# EAGLE design pomodoro_timer (EAGLE 7.2.0)
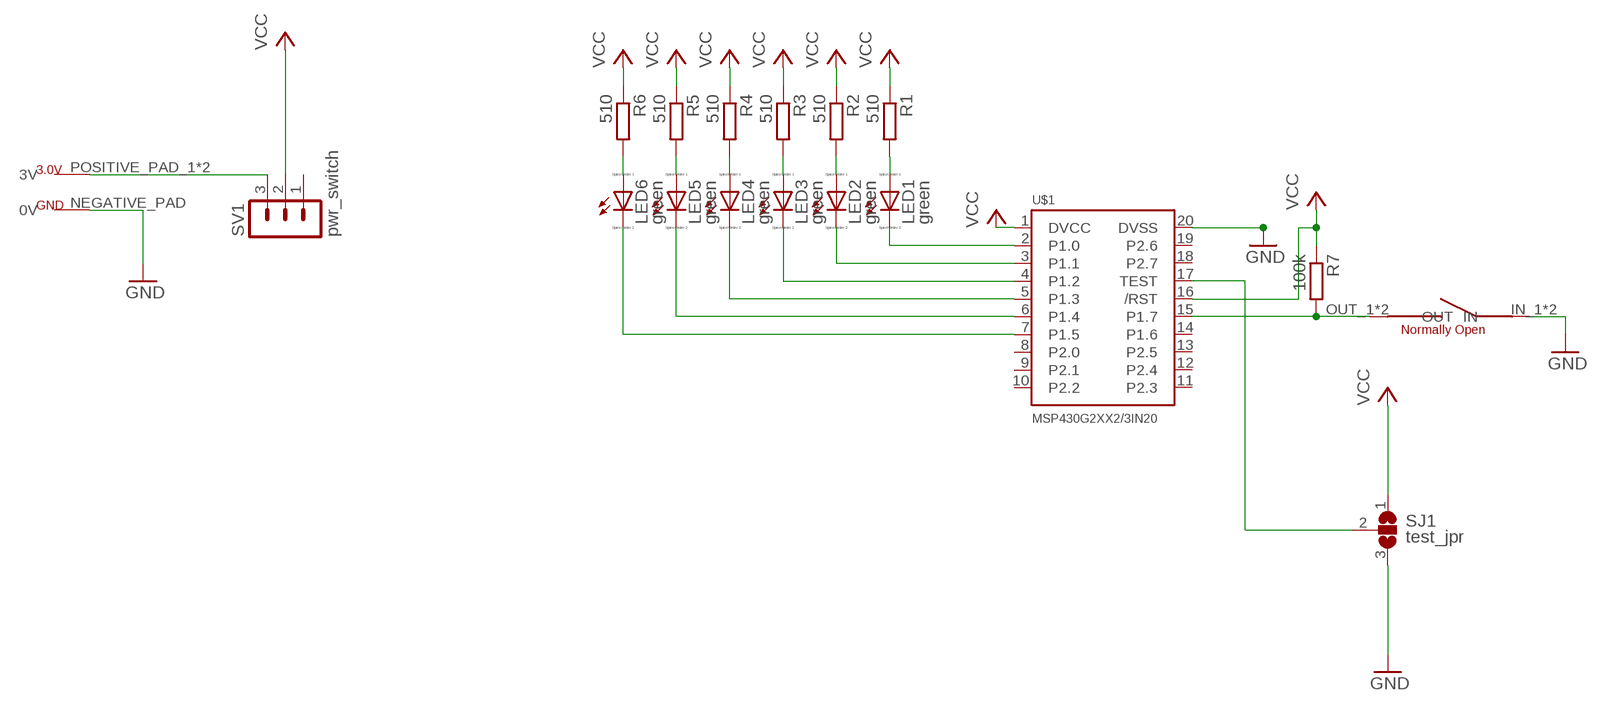
[diagram p0: schematic, sheet 1]

## Parts
LED1  green  LED_E  [LED_1206]
LED2  green  LED_E  [LED_1206]
LED3  green  LED_E  [LED_1206]
LED4  green  LED_E  [LED_1206]
LED5  green  LED_E  [LED_1206]
LED6  green  LED_E  [LED_1206]
R1  510  R-EU_M1206  [M1206]
R2  510  R-EU_M1206  [M1206]
R3  510  R-EU_M1206  [M1206]
R4  510  R-EU_M1206  [M1206]
R5  510  R-EU_M1206  [M1206]
R6  510  R-EU_M1206  [M1206]
R7  100k  R-EU_M1206  [M1206]
SJ1  test_jpr  SJ2W  [SJ_2]
SV1  pwr_switch  MA03-1  [MA03-1]
U$1  MSP430G2XX2/3IN20  [DIL20]
U$2  CR2032_HOLDERNORMAL  [CR2032_HOLDER]
U$3  SWITCH_SIMPLENORMAL  [SWITCH_SIMPLE]

## Nets
GND: SJ1.3 U$1.20(DVSS) U$2.NEGATIVE_PAD(0V) U$3.IN_1(IN) U$3.IN_2(IN)
N$2: LED1.C U$1.2(P1.0)
N$3: LED1.A R1.2
N$4: LED2.A R2.2
N$5: LED3.A R3.2
N$6: LED4.A R4.2
N$7: LED5.A R5.2
N$8: LED6.A R6.2
N$9: LED2.C U$1.3(P1.1)
N$10: LED3.C U$1.4(P1.2)
N$11: LED4.C U$1.5(P1.3)
N$12: LED5.C U$1.6(P1.4)
N$13: LED6.C U$1.7(P1.5)
N$14: R7.2 U$1.15(P1.7) U$3.OUT_1(OUT) U$3.OUT_2(OUT)
N$15: SJ1.2 U$1.17(TEST)
POS_BAT: SV1.3 U$2.POSITIVE_PAD_1(3V) U$2.POSITIVE_PAD_2(3V)
VCC: R1.1 R2.1 R3.1 R4.1 R5.1 R6.1 R7.1 SJ1.1 SV1.2 U$1.1(DVCC) U$1.16(/RST)
Unconnected: SV1.1 U$1.8(P2.0) U$1.9(P2.1) U$1.10(P2.2) U$1.11(P2.3) U$1.12(P2.4) U$1.13(P2.5) U$1.14(P1.6) U$1.18(P2.7) U$1.19(P2.6)

## Library data of the parts
LED1-LED6 = eagle-ltspice:LED_E: LED Source: http://www.osram.convergy.de Source: www.luxeon.com Source: www.kingbright.com; SPICEMODEL: NONE; SPICEPREFIX: D; SPICETYPE: diode
R1-R7 = resistor:R-EU_: RESISTOR, European symbol
SJ1 = jumper:SJ2W: SMD solder JUMPER
SV1 = con-lstb:MA03-1: PIN HEADER; OC_FARNELL: unknown; OC_NEWARK: unknown
U$1 = ti_msp430gxxx:MSP430G2XX2/3: Mixed Signal Microcontroller MSP430 Value Line MSP430G2432: 1x EEM, 8 KiB Flash Memory, 256 B RAM, 1x Timer_A, 1x USI, 8x ADC10 Ch, 16x I/O MSP430G2332: 1x EEM, 4 KiB Flash Memory, 256 B RAM, 1x Timer_A, 1x USI, 8x ADC10 Ch, 16x I/O MSP430G2232: 1x EEM, 2 KiB Flash Memory, 256 B RAM, 1x Timer_A, 1x USI, 8x ADC10 Ch, 16x I/O MSP430G2132: 1x EEM, 1 KiB Flash Memory, 128 B RAM, 1x Timer_A, 1x USI, 8x ADC10 Ch, 16x I/O MSP430G2402: 1x EEM, 8 KiB Flash Memory, 256 B RAM, 1x Timer_A, 1x USI, 16x I/O MSP430G2302: 1x EEM, 4 KiB Flash Memory, 256 B RAM, 1x Timer_A, 1x USI, 16x I/O MSP430G2202: 1x EEM, 2 KiB Flash Memory, 256 B RAM, 1x Timer_A, 1x USI, 16x I/O MSP430G2102: 1x EEM, 1 KiB Flash Memory, 128 B RAM, 1x Timer_A, 1x USI, 16x I/O MSP430G2452: 1x EEM, 8 KiB Flash Memory, 256 B RAM, 1x Timer_A, 8x Comp_A Ch, 1x USI, 8x ADC10 Ch, 16x I/O MSP430G2352: 1x EEM, 4 KiB Flash Memory, 256 B RAM, 1x Timer_A, 8x Comp_A Ch, 1x USI, 8x ADC10 Ch, 16x I/O MSP430G2252: 1x EEM, 2 KiB Flash Memory, 256 B RAM, 1x Timer_A, 8x Comp_A Ch, 1x USI, 8x ADC10 Ch, 16x I/O MSP430G2152: 1x EEM, 1 KiB Flash Memory, 128 B RAM, 1x Timer_A, 8x Comp_A Ch, 1x USI, 8x ADC10 Ch, 16x I/O MSP430G2412: 1x EEM, 8 KiB Flash Memory, 256 B RAM, 1x Timer_A, 8x Comp_A Ch, 1x USI, 16x I/O MSP430G2312: 1x EEM, 4 KiB Flash Memory, 256 B RAM, 1x Timer_A, 8x Comp_A Ch, 1x USI, 16x I/O MSP430G2212: 1x EEM, 2 KiB Flash Memory, 256 B RAM, 1x Timer_A, 8x Comp_A Ch, 1x USI, 16x I/O MSP430G2112: 1x EEM, 1 KiB Flash Memory, 128 B RAM, 1x Timer_A, 8x Comp_A Ch, 1x USI, 16x I/O MSP430G2533: 1x BSL, 1x EEM, 16 KiB Flash Memory, 512 B RAM, 2x Timer_A, 8x ADC10 Ch, 1x USCI A0/B0, 16x I/O MSP430G2433: 1x BSL, 1x EEM, 8 KiB Flash Memory, 512 B RAM, 2x Timer_A, 8x ADC10 Ch, 1x USCI A0/B0, 16x I/O MSP430G2333: 1x BSL, 1x EEM, 4 KiB Flash Memory, 256 B RAM, 2x Timer_A, 8x ADC10 Ch, 1x USCI A0/B0, 16x I/O MSP430G2233: 1x BSL, 1x EEM, 2 KiB Flash Memory, 256 B RAM, 2x Timer_A, 8x ADC10 Ch, 1x USCI A0/B0, 16x I/O MSP430G2403: 1x BSL, 1x EEM, 8 KiB Flash Memory, 512 B RAM, 2x Timer_A, 1x USCI A0/B0, 16x I/O MSP430G2303: 1x BSL, 1x EEM, 4 KiB Flash Memory, 256 B RAM, 2x Timer_A, 1x USCI A0/B0, 16x I/O MSP430G2203: 1x BSL, 1x EEM, 2 KiB Flash Memory, 256 B RAM, 2x Timer_A, 1x USCI A0/B0, 16x I/O MSP430G2553: 1x BSL, 1x EEM, 16 KiB Flash Memory, 512 B RAM, 2x Timer_A, 8x Comp_A+ Ch, 8x ADC10 Ch, 1x USCI A0/B0, 16x I/O MSP430G2453: 1x BSL, 1x EEM, 8 KiB Flash Memory, 512 B RAM, 2x Timer_A, 8x Comp_A+ Ch, 8x ADC10 Ch, 1x USCI A0/B0, 16x I/O MSP430G2353: 1x BSL, 1x EEM, 4 KiB Flash Memory, 256 B RAM, 2x Timer_A, 8x Comp_A+ Ch, 8x ADC10 Ch, 1x USCI A0/B0, 16x I/O MSP430G2253: 1x BSL, 1x EEM, 2 KiB Flash Memory, 256 B RAM, 2x Timer_A, 8x Comp_A+ Ch, 8x ADC10 Ch, 1x USCI A0/B0, 16x I/O MSP430G2153: 1x BSL, 1x EEM, 1 KiB Flash Memory, 256 B RAM, 2x Timer_A, 8x Comp_A+ Ch, 8x ADC10 Ch, 1x USCI A0/B0, 16x I/O MSP430G2513: 1x BSL, 1x EEM, 16 KiB Flash Memory, 512 B RAM, 2x Timer_A, 8x Comp_A+ Ch, 1x USCI A0/B0, 16x I/O MSP430G2413: 1x BSL, 1x EEM, 8 KiB Flash Memory, 512 B RAM, 2x Timer_A, 8x Comp_A+ Ch, 1x USCI A0/B0, 16x I/O MSP430G2313: 1x BSL, 1x EEM, 4 KiB Flash Memory, 256 B RAM, 2x Timer_A, 8x Comp_A+ Ch, 1x USCI A0/B0, 16x I/O MSP430G2213: 1x BSL, 1x EEM, 2 KiB Flash Memory, 256 B RAM, 2x Timer_A, 8x Comp_A+ Ch, 1x USCI A0/B0, 16x I/O MSP430G2113: 1x BSL, 1x EEM, 1 KiB Flash Memory, 256 B RAM, 2x Timer_A, 8x Comp_A+ Ch, 1x USCI A0/B0, 16x I/O
U$2 = CR2032_HOLDER:CR2032_HOLDER
U$3 = SWITCH_SIMPLE:SWITCH_SIMPLE

## Board
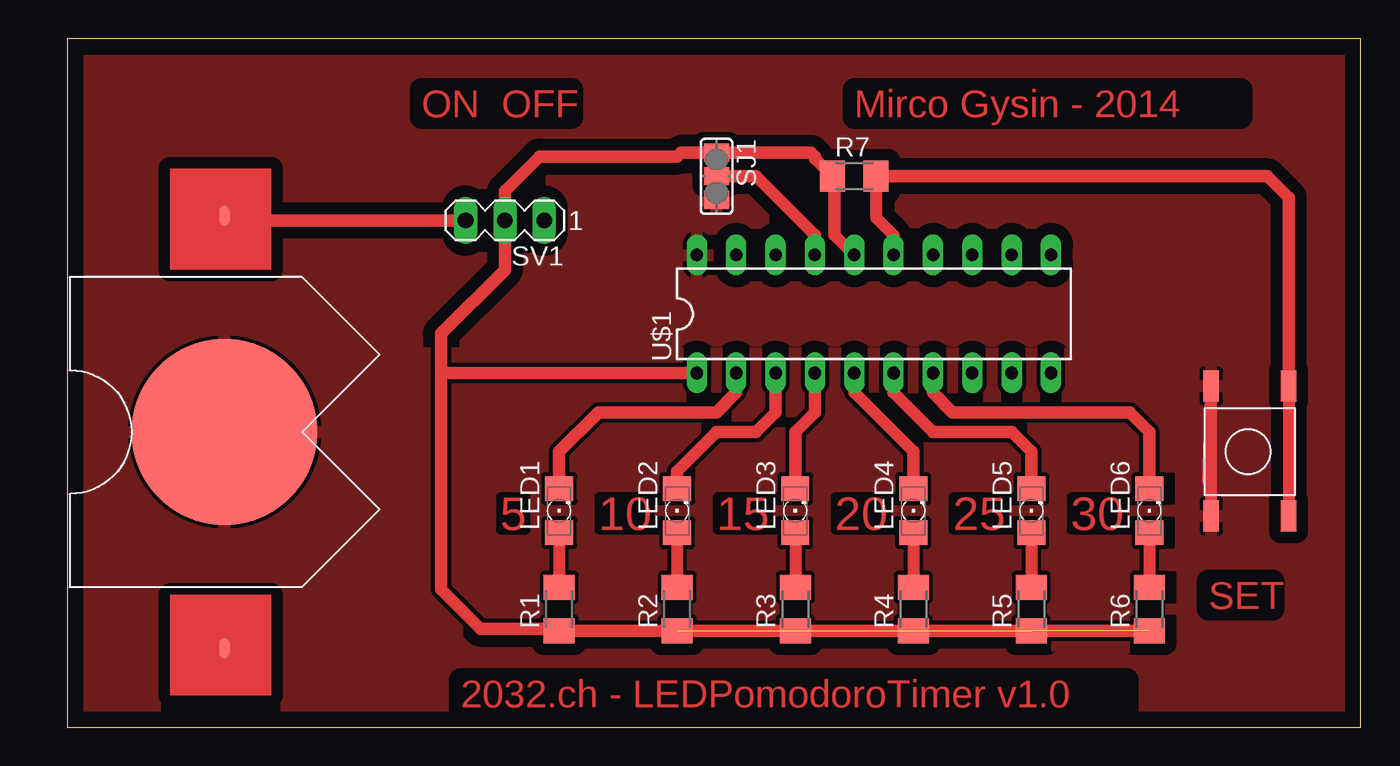
[diagram p1: board, top side]

Size 83.49 x 44.44 mm. Coordinates in mm from the lower left corner, seen from the top.
Outline: 0,0 83.49,0 83.49,44.44 0,44.44 0,0
Copper layers (1*16): Top 0.035mm / dielectric 1.5mm / Bottom 0.035mm
Design rules "default": minimum track width 10mil, minimum drill 24mil, track to track 8mil, track to pad 8mil, pad to pad 8mil, via to via 8mil, smd to smd 8mil, copper to edge 40mil, drill to drill 8mil, minimum pad ring 10mil, minimum via ring 8mil, stop-mask expansion 4mil, vias tented up to drill 0mil, thermal gap 10mil

### Footprints (pad centres in the part's own frame; a part is rotated, then mirrored left to right if it is on the bottom)
LED_1206 = smd 1.6 x 1.803: A -1.422,0; C 1.422,0
M1206 = smd 1.6 x 2: 1 -1.4,0; 2 1.4,0
SJ_2 = smd 1.168 x 1.6: 1 -1.524,0; 2 0,0; 3 1.524,0
MA03-1 = drill 1.016 long: 1 -2.54,0; 2 0,0; 3 2.54,0
DIL20 = drill 0.813 long: 1 -11.43,-3.81; 2 -8.89,-3.81; 3 -6.35,-3.81; 4 -3.81,-3.81; 5 -1.27,-3.81; 6 1.27,-3.81; 7 3.81,-3.81; 8 6.35,-3.81; 9 8.89,-3.81; 10 11.43,-3.81; 11 11.43,3.81; 12 8.89,3.81; 13 6.35,3.81; 14 3.81,3.81; 15 1.27,3.81; 16 -1.27,3.81; 17 -3.81,3.81; 18 -6.35,3.81; 19 -8.89,3.81; 20 -11.43,3.81
CR2032_HOLDER = smd 12 x 12: NEGATIVE_PAD 0,0 | smd 1.27 x 0.635: POSITIVE_PAD_1 -13.97,0; POSITIVE_PAD_2 13.97,0
SWITCH_SIMPLE = smd 2 x 1: IN_1 -4.162,2.362; IN_2 4.238,2.362; OUT_1 -4.162,-2.638; OUT_2 4.238,-2.638

### Placement (x,y rotation side)
LED1  31.75,13.97 90 top
LED2  39.37,13.97 90 top
LED3  46.99,13.97 90 top
LED4  54.61,13.97 90 top
LED5  62.23,13.97 90 top
LED6  69.85,13.97 90 top
R1  31.75,7.62 90 top
R2  39.37,7.62 90 top
R3  46.99,7.62 90 top
R4  54.61,7.62 90 top
R5  62.23,7.62 90 top
R6  69.85,7.62 90 top
R7  50.8,35.56 0 top
SJ1  41.91,35.56 270 top
SV1  28.25,32.71 180 top
U$1  52.07,26.67 0 top
U$2  10.16,19.05 270 top
U$3  76.2,17.78 90 top

### Tracks (layer width: path | path; a pad name or v marks a point on that pad's centre or on a via)
GND
  Top 0.762: U$3.IN_1 U$3.IN_2 73.66,15.85
  pour Top (isolate 0.762): 1.27,43.18 82.55,43.18 82.55,1.27 1.27,1.27
N$1
  pour Top (isolate 0.254): 21.59,24.13 21.59,6.35 71.12,5.08 71.12,24.13
N$2
  Top 0.813: U$1.2 43.18,21.59 41.91,20.32 34.29,20.32 31.75,17.78 LED1.C
N$3
  Top 0.762: LED1.A R1.2
N$4
  Top 0.762: LED2.A R2.2
N$5
  Top 0.762: LED3.A R3.2
N$6
  Top 0.762: LED4.A R4.2
N$7
  Top 0.762: LED5.A R5.2
N$8
  Top 0.762: LED6.A R6.2
N$9
  Top 0.813: U$1.3 45.72,20.32 44.45,19.05 41.91,19.05 39.37,16.51 LED2.C
N$10
  Top 0.813: U$1.4 48.26,20.32 46.99,19.05 LED3.C
N$11
  Top 0.813: U$1.5 50.8,21.59 54.61,17.78 LED4.C
N$12
  Top 0.813: U$1.6 53.34,21.59 55.88,19.05 60.96,19.05 62.23,17.78 LED5.C
N$13
  Top 0.813: U$1.7 55.88,21.59 57.15,20.32 68.58,20.32 69.85,19.05 LED6.C
N$14
  Top 0.762: U$3.OUT_2 U$3.OUT_1 | R7.2 52.2,32.89 53.34,31.75 U$1.15
  Top 0.813: U$3.OUT_2 78.84,34.19 77.47,35.56 R7.2
N$15
  Top 0.813: U$1.17 48.26,31.75 44.45,35.56 SJ1.2
POS_BAT
  Top 0.813: SV1.3 10.47,32.71 U$2.POSITIVE_PAD_1
VCC  (4 unrouted)
  Top 0.813: U$1.16 49.53,31.75 49.53,35.43 R7.1 48.26,36.7 48.26,36.83 48.01,37.08 SJ1.1 39.62,37.08 39.37,36.83 30.48,36.83 28.25,34.6 SV1.2 28.25,29.52 24.13,25.4 24.13,22.86 | R6.1 R1.1 31.62,6.35 26.67,6.35 24.13,8.89 24.13,22.86 | U$1.1 24.13,22.86

### Text on the board
Top: ON OFF | Mirco Gysin - 2014 | 5 | 10 | 15 | 20 | 25 | 30 | SET | 2032.ch - LEDPomodoroTimer v1.0